# Altium schematic sheet 14_JTAG_DBG.SchDoc
size A4; SheetNumber: 15; SheetTotal: 24
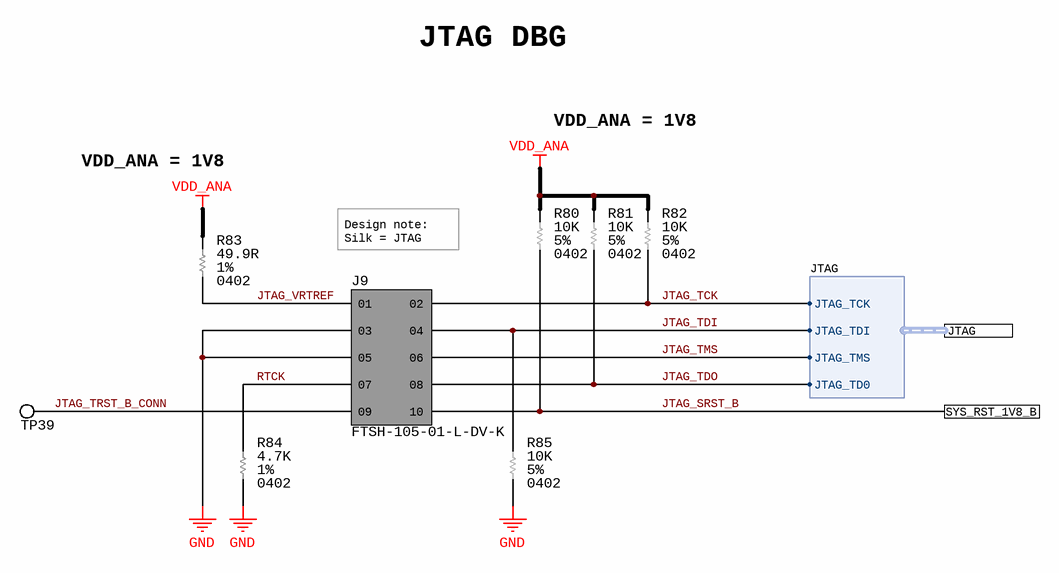
[diagram p0: 14_JTAG_DBG.SchDoc]

## Parts
J9  FTSH-105-01-L-DV-K  [SAMTEC_FTSH-105-XX-X-DV]
R80  Tolerance: 5%  Resistance: 10K  Case/Package: 0402  [RES_0402_RESC1005X04N]  (hidden comment: ERJ-2GEJ103X)
R81  Tolerance: 5%  Resistance: 10K  Case/Package: 0402  [RES_0402_RESC1005X04N]  (hidden comment: ERJ-2GEJ103X)
R82  Tolerance: 5%  Resistance: 10K  Case/Package: 0402  [RES_0402_RESC1005X04N]  (hidden comment: ERJ-2GEJ103X)
R83  Resistance: 49.9R  Tolerance: 1%  Case/Package: 0402  [RES_0402_RESC1005X04N]  (hidden comment: CR0402-FX-49R9GLF)
R84  Tolerance: 1%  Case Code (Imperial): 0402  Resistance: 4.7K  [RES_0402_RESC1005X04N]  (hidden comment: ERJ-2RKF4701X)
R85  Tolerance: 5%  Resistance: 10K  Case/Package: 0402  [RES_0402_RESC1005X04N]  (hidden comment: ERJ-2GEJ103X)
TP39  NO COMPONENT  [TP_PAD_0.5MM_SMD_ROUND]  (value not drawn)  (no BOM)

## Ports
JTAG (harness JTAG), SYS_RST_1V8_B

## Harnesses
JTAG: JTAG_TD0, JTAG_TMS, JTAG_TDI, JTAG_TCK

## Nets
GND: J9.03 J9.05 R84.1 R85.1
VDD_ANA: R80.2 R81.2 R82.2 R83.2
JTAG_SRST_B: J9.10 R80.1 ; port SYS_RST_1V8_B
JTAG_TCK: J9.02 R82.1 ; port JTAG.JTAG_TCK
JTAG_TDI: J9.04 R85.2 ; port JTAG.JTAG_TDI
JTAG_TDO: J9.08 R81.1 ; port JTAG.JTAG_TD0
JTAG_TMS: J9.06 ; port JTAG.JTAG_TMS
JTAG_TRST_B_CONN: J9.09 TP39.1
JTAG_VRTREF: J9.01 R83.1
RTCK: J9.07 R84.2

## Notes on the sheet
- JTAG DBG
- VDD_ANA = 1V8
- Design note:
  Silk = JTAG
- PCB Des :
- Approv By :
- Project Title :
- Sheet Title :
- Date :
- PCB Version :
- Size :
- A4
- Page :
- PCB Revision :

## Library data of the parts
J9 = CONN_HEADER_JTAG_10P_2R_FTSH-105-01-L-DV-K: Pin Header, Board-to-Board, Wire-to-Board, 1.27 mm, 2 Rows, 10 Contacts, Surface Mount; Manufacturer: Samtec; Number of Contacts: 10; Gender: Female; Max Current Rating: 1.75A; Pitch: 1.27mm; Row Spacing: 0.05inch; Supplier 1: Digikey; Manufacturer Part Number: FTSH-105-01-L-DV-K; RoHS: Yes; Category: Headers and Wire Housings; Stock 1: 41371; Pricing 1: 1=2.48, 100=1.95, 250=1.76, 500=1.55, 1000=1.36, 2500=1.23, 5000=1.15, 10000=0.99 (USD); Mount: Surface Mount; Contact Plating: Gold; Contact Material: Bronze; Housing Color: Black; Color: Black; Min Operating Temperature: -55°C; Max Operating Temperature: 125°C; Number of Rows: 2; Packaging: Rail/Tube; Termination: Solder; Number of Positions: 10; Orientation: Straight; Series: FTSH; Contact Type: Male Pin; Package Quantity: 1; Length: 6.35mm; Depth: 3.43mm; Contact Mating Length: 0.12inch; Radiation Hardening: No; RoHS Compliant: Yes; Lead Free: Lead Free; Reach SVHC Compliant: No; ComponentLink1URL: https://datasheet.ciiva.com/26936/getdatasheetpartid-175877-26936879.pdf?src-supplier=Verical; ComponentLink1Description: https://datasheet.ciiva.com/26936/getdatasheetpartid-175877-26936879.pdf?src-supplier=Verical; ComponentLink2URL: https://datasheet.ciiva.com/728/ftsh-1xx-xx-xxx-dv-xxx-mkt-728872.pdf?src-supplier=Digikey; ComponentLink2Description: https://datasheet.ciiva.com/728/ftsh-1xx-xx-xxx-dv-xxx-mkt-728872.pdf?src-supplier=Digikey; ComponentLink3URL: https://datasheet.ciiva.com/10245/ftsh-mt-10245272.pdf?src-supplier=Avnet; ComponentLink3Description: https://datasheet.ciiva.com/10245/ftsh-mt-10245272.pdf?src-supplier=Avnet; ComponentLink4URL: https://datasheet.ciiva.com/22703/ftsh-smt-22703900.pdf?src-supplier=Element14; ComponentLink4Description: https://datasheet.ciiva.com/22703/ftsh-smt-22703900.pdf?src-supplier=Element14; Supplier Part Number 1: SAM8799-ND
R80-R82 R85 = RES_10K_5%_100mW_0402: Res Thick Film 0402 10K Ohm 5% 1/10W ±200ppm/°C Molded SMD Punched Carrier T/R; Manufacturer: Panasonic; Power Rating: 100mW; Voltage Rating: 50V; Supplier 1: Digi-Key; Manufacturer Part Number: ERJ-2GEJ103X; RoHS: Yes; Category: Chip SMD Resistors; Stock 1: 4696986; Pricing 1: 1=0.1, 10=0.021, 50=0.0132, 100=0.011, 500=0.00744, 1000=0.00639, 5000=0.00464 (USD); Mount: Surface Mount; Contact Plating: Tin; Case Code (Metric): 1005; Case Code (Imperial): 0402; Size Code: 0402; Min Operating Temperature: -55°C; Max Operating Temperature: 155°C; Temperature Coefficient: 200ppm/°C; Packaging: Cut Tape; Resistor Type: Thick Film; Package Quantity: 10000; Number of Terminations: 2; Termination: SMD/SMT; Max Power Dissipation: 100mW; Features: Automotive AEC-Q200; Series: ERJ; Resistance Tolerance: 5%; Technology: THICK FILM; Voltage Rating (DC): 50V; Length: 1mm; Width: 0.5mm; Height: 0.35mm; Depth: 0.5mm; Ratings: AEC-Q200; Radiation Hardening: No; Reach SVHC Compliant: No; RoHS Compliant: Yes; Lead Free: 5697LeadFree; ComponentLink1URL: https://datasheet.ciiva.com/27055/1935721-27055112.pdf?src-supplier=Jameco; ComponentLink1Description: https://datasheet.ciiva.com/27055/1935721-27055112.pdf?src-supplier=Jameco; ComponentLink2URL: https://datasheet.ciiva.com/11821/0900766b80f806dd-11821170.pdf?src-supplier=Rs; ComponentLink2Description: https://datasheet.ciiva.com/11821/0900766b80f806dd-11821170.pdf?src-supplier=Rs; ComponentLink3URL: https://datasheet.ciiva.com/43460/1678796-43460391.pdf?src-supplier=Farnell; ComponentLink3Description: https://datasheet.ciiva.com/43460/1678796-43460391.pdf?src-supplier=Farnell; ComponentLink4URL: https://datasheet.ciiva.com/22785/1678796-22785949.pdf?src-supplier=Farnell; ComponentLink4Description: https://datasheet.ciiva.com/22785/1678796-22785949.pdf?src-supplier=Farnell; ComponentLink5URL: https://datasheet.ciiva.com/46371/1678796-46371910.pdf?src-supplier=Element14; ComponentLink5Description: https://datasheet.ciiva.com/46371/1678796-46371910.pdf?src-supplier=Element14; ComponentLink6URL: https://datasheet.ciiva.com/28514/1678796-28514154.pdf?src-supplier=Element14; ComponentLink6Description: https://datasheet.ciiva.com/28514/1678796-28514154.pdf?src-supplier=Element14; ComponentLink7URL: https://datasheet.ciiva.com/24070/aoa0000ce1-37422-24070679.pdf?src-supplier=Mouser; ComponentLink7Description: https://datasheet.ciiva.com/24070/aoa0000ce1-37422-24070679.pdf?src-supplier=Mouser; ComponentLink8URL: https://datasheet.ciiva.com/16767/70260739-16767130.pdf?src-supplier=Allied+Electronics; ComponentLink8Description: https://datasheet.ciiva.com/16767/70260739-16767130.pdf?src-supplier=Allied+Electronics; ComponentLink9URL: https://datasheet.ciiva.com/16774/70260739-16774504.pdf?src-supplier=Allied+Electronics; ComponentLink9Description: https://datasheet.ciiva.com/16774/70260739-16774504.pdf?src-supplier=Allied+Electronics; ComponentLink10URL: https://datasheet.ciiva.com/9194/aoa0000ce1-9194140.pdf?src-supplier=Avnet; ComponentLink10Description: https://datasheet.ciiva.com/9194/aoa0000ce1-9194140.pdf?src-supplier=Avnet; Supplier Part Number 1: P10KJCT-ND
R83 = RES_49.9R_1%_63mW_0402: SMD Chip Resistor, 49.9 Ohm, ± 1%, 63 mW, 0402 [1005 Metric], Thick Film, General Purpose; Manufacturer: Bourns; Power Rating: 62.5mW; Voltage Rating: 50V; Temperature Coefficient: 100ppm/°C; Max Power Dissipation: 63mW; Supplier 1: Digi-Key; Manufacturer Part Number: CR0402-FX-49R9GLF; RoHS: Yes; Category: Chip SMD Resistors; Stock 1: 1080172; Pricing 1: 1=0.1, 10=0.012, 50=0.0064, 100=0.0052, 500=0.00332, 1000=0.0028, 5000=0.00193 (USD); Mount: Surface Mount; Case Code (Metric): 1005; Case Code (Imperial): 0402; Contact Plating: Tin; Min Operating Temperature: -55°C; Max Operating Temperature: 125°C; Packaging: Tape and Reel; Package Quantity: 1; Number of Terminations: 2; Termination: SMD/SMT; Voltage Rating (DC): 50V; Series: CR0402; Length: 0.039inch; Width: 0.5mm; Height: 0.016inch; Thickness: 356um; Radiation Hardening: No; RoHS Compliant: Yes; ComponentLink1URL: https://datasheet.ciiva.com/6562/cr0402-6562967.pdf?src-supplier=Digi-Key; ComponentLink1Description: https://datasheet.ciiva.com/6562/cr0402-6562967.pdf?src-supplier=Digi-Key; Supplier Part Number 1: CR0402-FX-49R9GLFCT-ND
R84 = RES_4.7K_1%_100mW_0402: Res Thick Film 0402 4.7K Ohm 1% 0.1W ±100ppm/°C Molded SMD Punched Carrier T/R; Manufacturer: Panasonic; Power Rating: 100mW; Voltage Rating: 50V; Supplier 1: Digi-Key; Manufacturer Part Number: ERJ-2RKF4701X; RoHS: Yes; Category: Chip SMD Resistors; Stock 1: 2269675; Pricing 1: 1=0.1, 10=0.024, 50=0.015, 100=0.0125, 500=0.00848, 1000=0.00731, 5000=0.00531 (USD); Case Code (Metric): 1005; Weight: 0.000388oz; Min Operating Temperature: -55°C; Max Operating Temperature: 155°C; Temperature Coefficient: 100ppm/°C; Packaging: Cut Tape; Package Quantity: 10000; Termination: SMD/SMT; Voltage Rating (DC): 50V; Series: ERJ-2Rx; Technology: THICK FILM; Length: 1mm; Width: 0.5mm; Height: 0.35mm; Lead Free: Lead Free; RoHS Compliant: Yes; ComponentLink1URL: https://datasheet.ciiva.com/30053/aoa0000ce2-30053990.pdf?src-supplier=Onlinecomponents.com; ComponentLink1Description: https://datasheet.ciiva.com/30053/aoa0000ce2-30053990.pdf?src-supplier=Onlinecomponents.com; ComponentLink2URL: https://datasheet.ciiva.com/7830/aoa0000ce2-7830727.pdf?src-supplier=Element14; ComponentLink2Description: https://datasheet.ciiva.com/7830/aoa0000ce2-7830727.pdf?src-supplier=Element14; ComponentLink3URL: https://datasheet.ciiva.com/22781/1678782-22781576.pdf?src-supplier=Farnell; ComponentLink3Description: https://datasheet.ciiva.com/22781/1678782-22781576.pdf?src-supplier=Farnell; ComponentLink4URL: https://datasheet.ciiva.com/22667/1678782-22667886.pdf?src-supplier=Element14; ComponentLink4Description: https://datasheet.ciiva.com/22667/1678782-22667886.pdf?src-supplier=Element14; ComponentLink5URL: https://datasheet.ciiva.com/22723/1678782-22723903.pdf?src-supplier=Element14; ComponentLink5Description: https://datasheet.ciiva.com/22723/1678782-22723903.pdf?src-supplier=Element14; Supplier Part Number 1: P4.70KLCT-ND
TP39 = TP_PAD_SMD_SMALL: Test Point, SMD pad, round, 1.5mm, 1.6mm, 3mm diameter